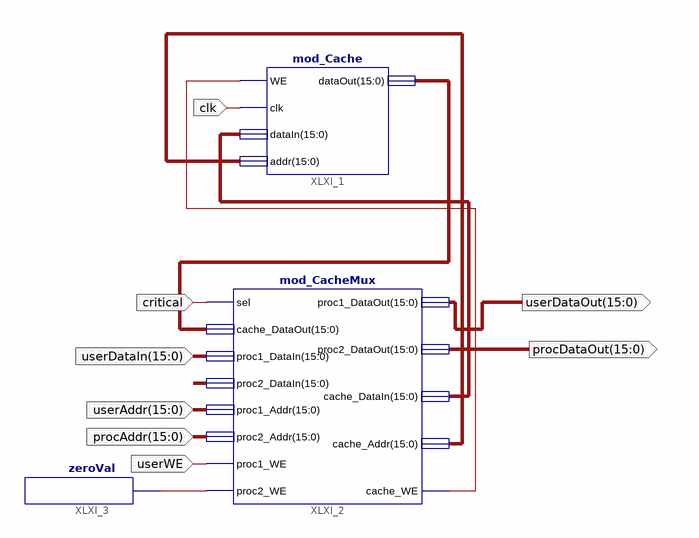
[diagram p0: schematic sheet 1]
// Xilinx ISE schematic mod_ParamsUPDATE.sch (spartan3e) as structural Verilog: 3 symbols, 8 ports
module mod_ParamsUPDATE (
  input  critical,
  input  clk,
  input  userWE,
  input  [15:0] procAddr,
  input  [15:0] userAddr,
  input  [15:0] userDataIn,
  output [15:0] userDataOut,
  output [15:0] procDataOut
);

  wire XLXN_1, XLXN_11;
  wire [15:0] XLXN_2, XLXN_3, XLXN_4, XLXN_13;

  mod_Cache XLXI_1 (.WE(XLXN_1), .clk(clk), .dataIn(XLXN_2), .addr(XLXN_3), .dataOut(XLXN_4));
  mod_CacheMux XLXI_2 (
    .sel(critical), .cache_DataOut(XLXN_4), .proc1_DataIn(userDataIn), .proc2_DataIn(XLXN_13),
    .proc1_Addr(userAddr), .proc2_Addr(procAddr), .proc1_WE(userWE), .proc2_WE(XLXN_11),
    .proc1_DataOut(userDataOut), .proc2_DataOut(procDataOut), .cache_DataIn(XLXN_2), .cache_Addr(XLXN_3),
    .cache_WE(XLXN_1));
  zeroVal XLXI_3 (.zero(XLXN_11));
endmodule
